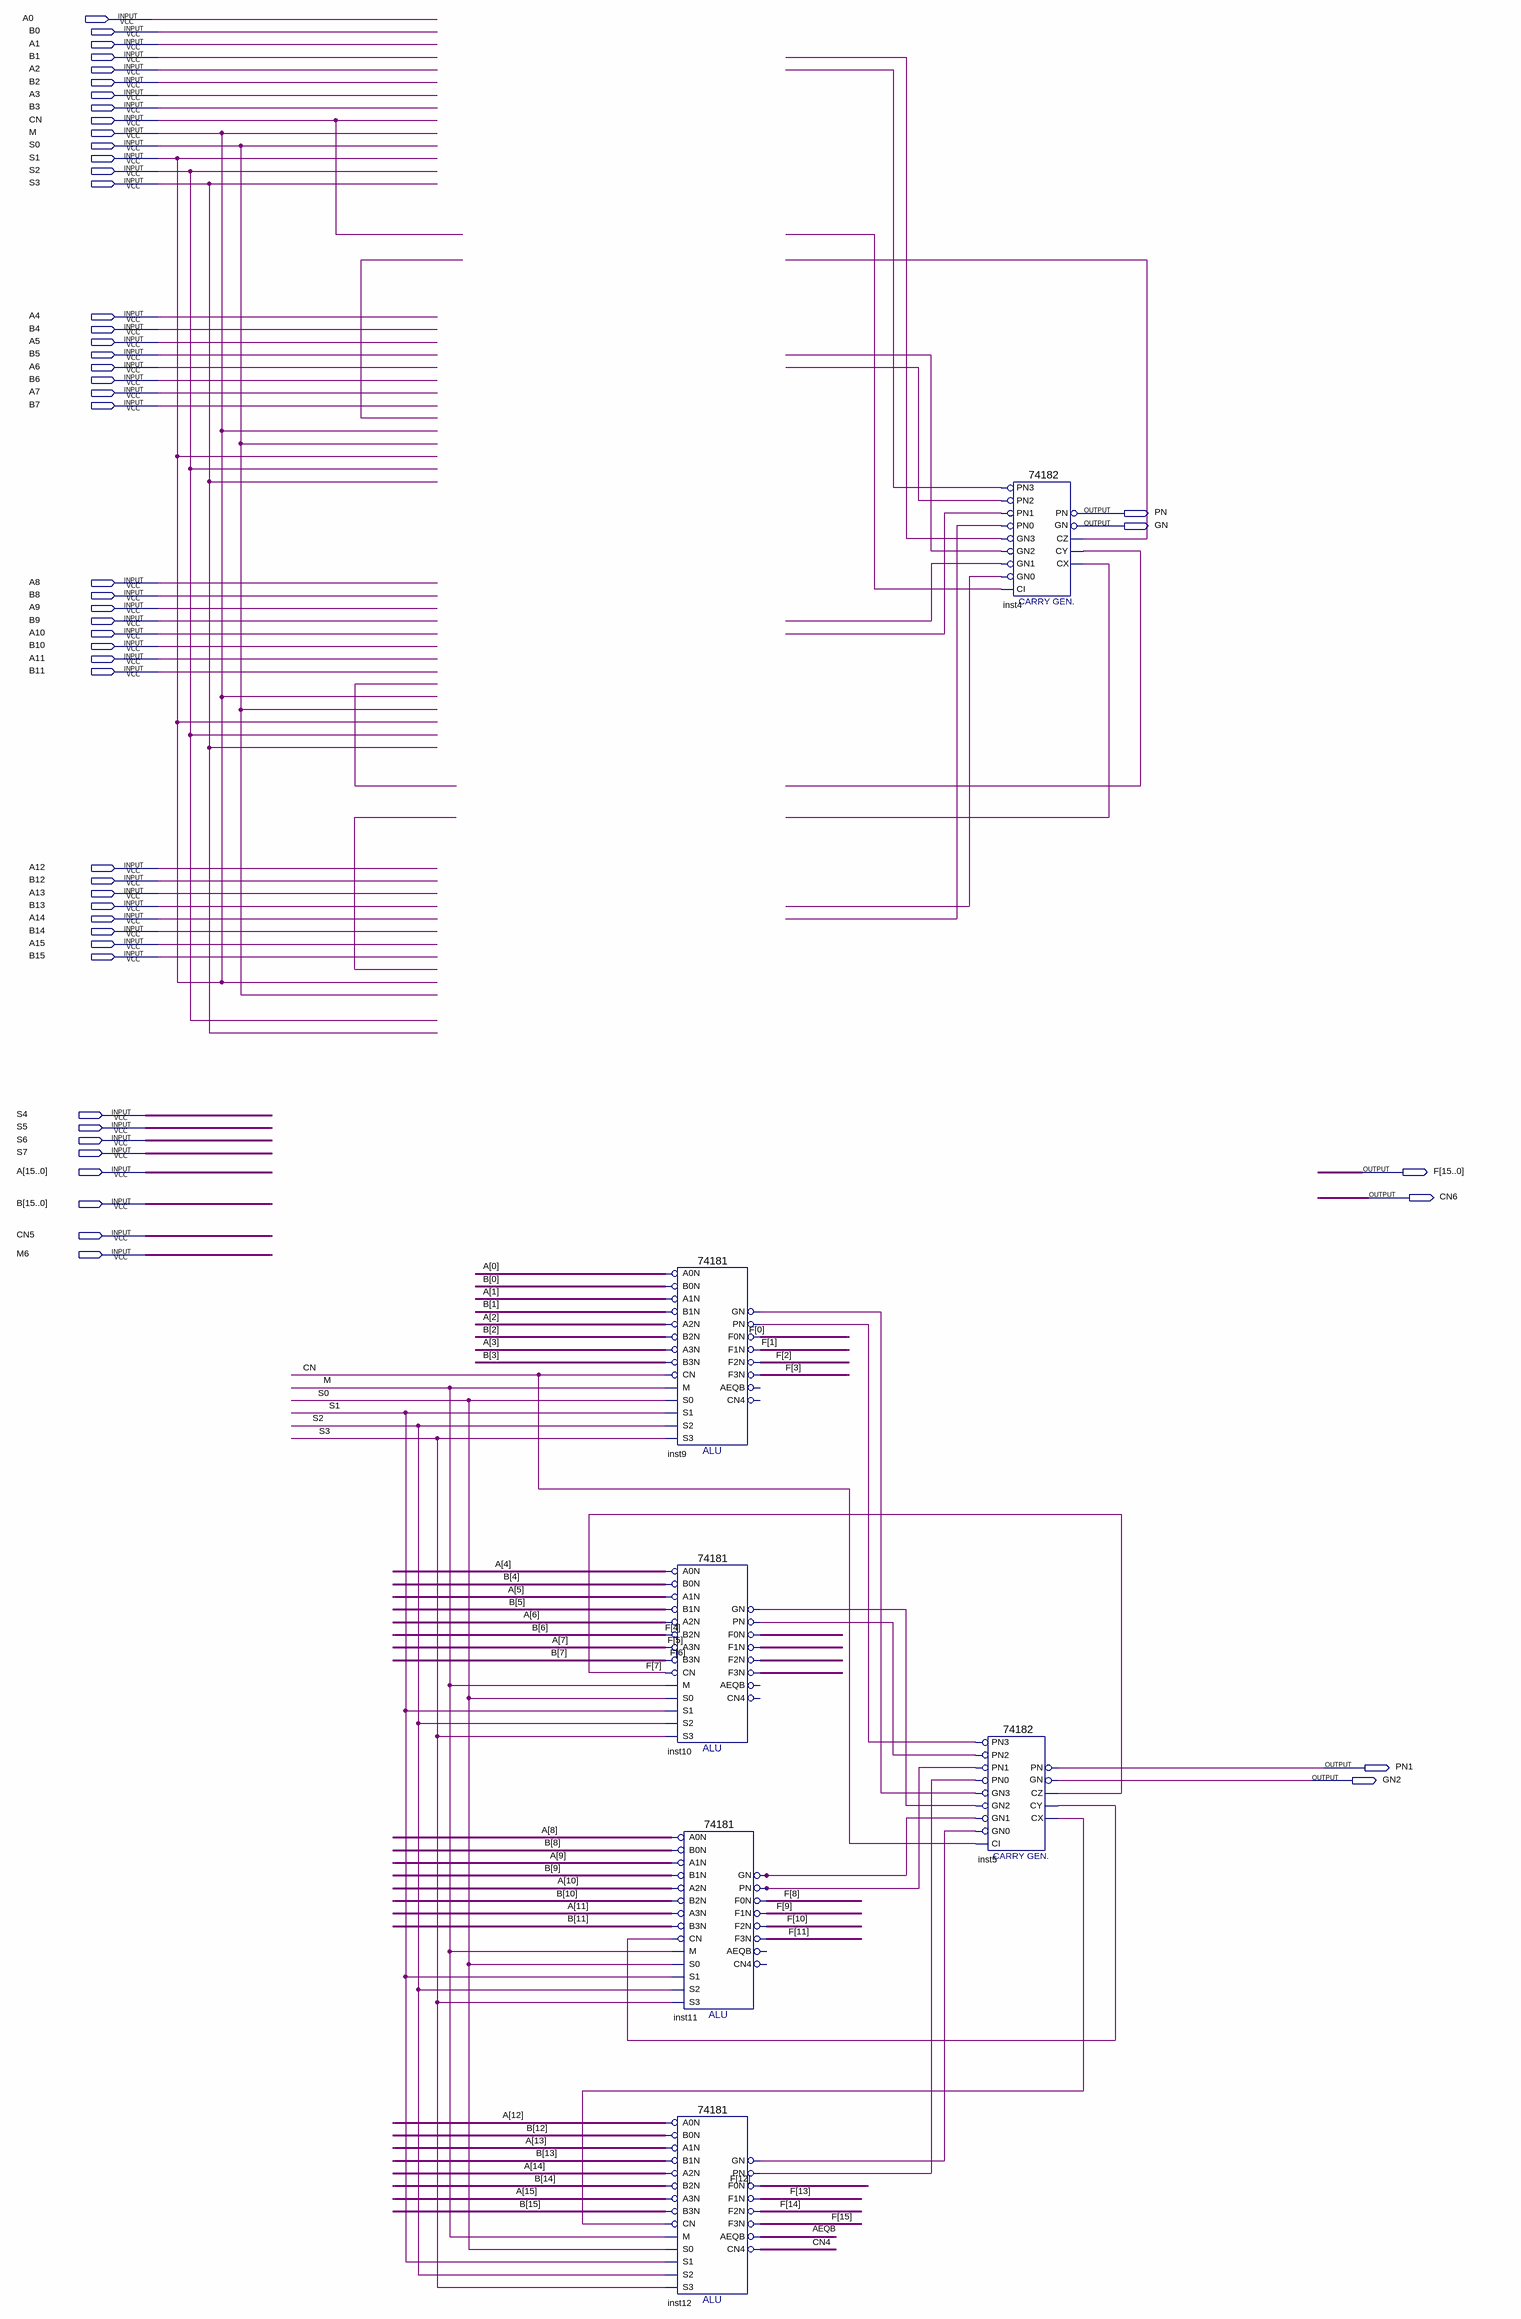
[diagram p0: schematic sheet]
// Quartus schematic A274181b.bdf as structural Verilog: 6 symbols, 52 pins
module A274181b (
  input  A0,
  input  B0,
  input  A1,
  input  B1,
  input  A2,
  input  B2,
  input  A3,
  input  B3,
  input  CN,
  input  M,
  input  S0,
  input  S1,
  input  S2,
  input  S3,
  input  A4,
  input  B4,
  input  A5,
  input  B5,
  input  A6,
  input  B6,
  input  A7,
  input  B7,
  input  A8,
  input  B8,
  input  A9,
  input  B9,
  input  A10,
  input  B10,
  input  A11,
  input  B11,
  input  A12,
  input  B12,
  input  A13,
  input  B13,
  input  A14,
  input  B14,
  input  A15,
  input  B15,
  input  S4,
  input  S5,
  input  S6,
  input  S7,
  input  [15:0] A,
  input  [15:0] B,
  input  CN5,
  input  M6,
  output PN,
  output GN,
  output [15:0] F,
  output CN6,
  output PN1,
  output GN2
);

  wire AEQB, CN4, inst4_cx, inst4_cy, inst4_cz, inst5_cx, inst5_cy, inst5_cz, inst9_gn, inst9_pn, inst10_gn,
       inst10_pn, inst11_gn, inst11_pn, inst12_gn, inst12_pn, undriven, undriven_2, undriven_3, undriven_4,
       undriven_5, undriven_6, undriven_7, undriven_8, undriven_9;

  \74181  inst9 (
    .B0N(B[0]), .A0N(A[0]), .A1N(A[1]), .B1N(B[1]), .A3N(A[3]), .B2N(B[2]), .A2N(A[2]), .M(M), .CN(CN),
    .B3N(B[3]), .S2(S2), .S1(M), .S0(S0), .S3(S3), .PN(inst9_pn), .GN(inst9_gn), .F3N(F[3]), .F1N(F[1]),
    .F0N(F[0]), .F2N(F[2]));  // open: AEQB, CN4
  \74181  inst10 (
    .B0N(B[4]), .A0N(A[4]), .A1N(A[5]), .B1N(B[5]), .A3N(A[7]), .B2N(B[6]), .A2N(A[6]), .M(M), .CN(inst5_cz),
    .B3N(B[7]), .S2(S2), .S1(M), .S0(S0), .S3(S3), .PN(inst10_pn), .GN(inst10_gn), .F3N(F[7]), .F1N(F[5]),
    .F0N(F[4]), .F2N(F[6]));  // open: AEQB, CN4
  \74181  inst11 (
    .B0N(B[8]), .A0N(A[8]), .A1N(A[9]), .B1N(B[9]), .A3N(A[11]), .B2N(B[10]), .A2N(A[10]), .M(M),
    .CN(inst5_cy), .B3N(B[11]), .S2(S2), .S1(M), .S0(S0), .S3(S3), .PN(inst11_pn), .GN(inst11_gn),
    .F3N(F[11]), .F1N(F[9]), .F0N(F[8]), .F2N(F[10]));  // open: AEQB, CN4
  \74181  inst12 (
    .B0N(B[12]), .A0N(A[12]), .A1N(A[13]), .B1N(B[13]), .A3N(A[15]), .B2N(B[14]), .A2N(A[14]), .M(M),
    .CN(inst5_cx), .B3N(B[15]), .S2(S2), .S1(M), .S0(S0), .S3(S3), .PN(inst12_pn), .GN(inst12_gn),
    .F3N(F[15]), .F1N(F[13]), .F0N(F[12]), .AEQB(AEQB), .CN4(CN4), .F2N(F[14]));
  \74182  inst5 (
    .PN2(inst10_pn), .GN2(inst10_gn), .GN3(inst9_gn), .PN3(inst9_pn), .CI(CN), .PN1(inst11_pn),
    .PN0(inst12_pn), .GN1(inst11_gn), .GN0(inst12_gn), .CY(inst5_cy), .PN(PN1), .CX(inst5_cx), .CZ(inst5_cz),
    .GN(GN2));
  \74182  inst4 (
    .PN2(undriven_6), .GN2(undriven_5), .GN3(undriven_7), .PN3(undriven_8), .CI(undriven_9),
    .PN1(undriven_3), .PN0(undriven_2), .GN1(undriven_4), .GN0(undriven), .CY(inst4_cy), .PN(PN),
    .CX(inst4_cx), .CZ(inst4_cz), .GN(GN));

  assign S1 = M;
endmodule
